# Altium schematic sheet Tp_7seg_Drivers.SchDoc
size A4
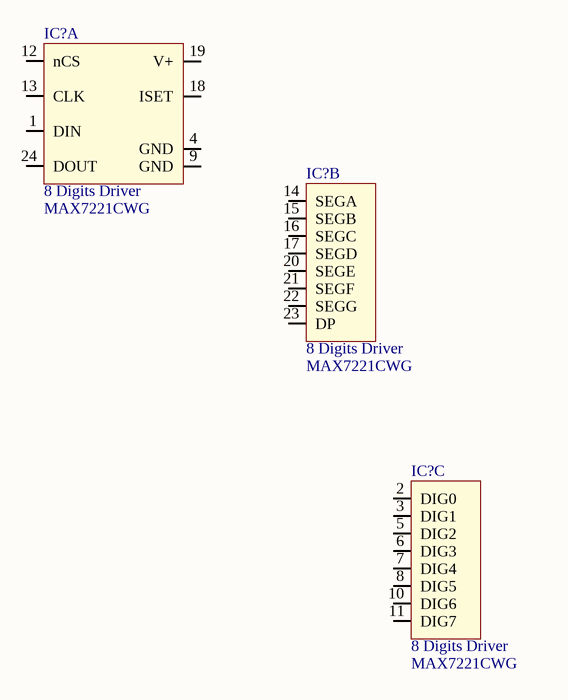
[diagram p0: Tp_7seg_Drivers.SchDoc]

## Parts
(Parts that share a designator on the sheet are numbered #1, #2 ... from top to bottom, then left to right.)
IC?#1  8 Digits Driver  [MAX7221CWG]  (part A of 3)
IC?#2  8 Digits Driver  [MAX7221CWG]  (part B of 3)
IC?#3  8 Digits Driver  [MAX7221CWG]  (part C of 3)

## Nets

Not connected (* = marked no-connect by the designer): IC?#1 1(DIN) 4(GND) 9(GND) 12(nCS) 13(CLK) 18(ISET) 19(V+) 24(DOUT); IC?#2 14(SEGA) 15(SEGB) 16(SEGC) 17(SEGD) 20(SEGE) 21(SEGF) 22(SEGG) 23(DP); IC?#3 2(DIG0) 3(DIG1) 5(DIG2) 6(DIG3) 7(DIG4) 8(DIG5) 10(DIG6) 11(DIG7)

## Library data of the parts
IC?#1-IC?#3 = MAX7221: MAX7221 8 Digit 7 Segments Display; Reference: MAX7221CWG